# EAGLE design SBC-Accelerometer-v10 (EAGLE 6.3)
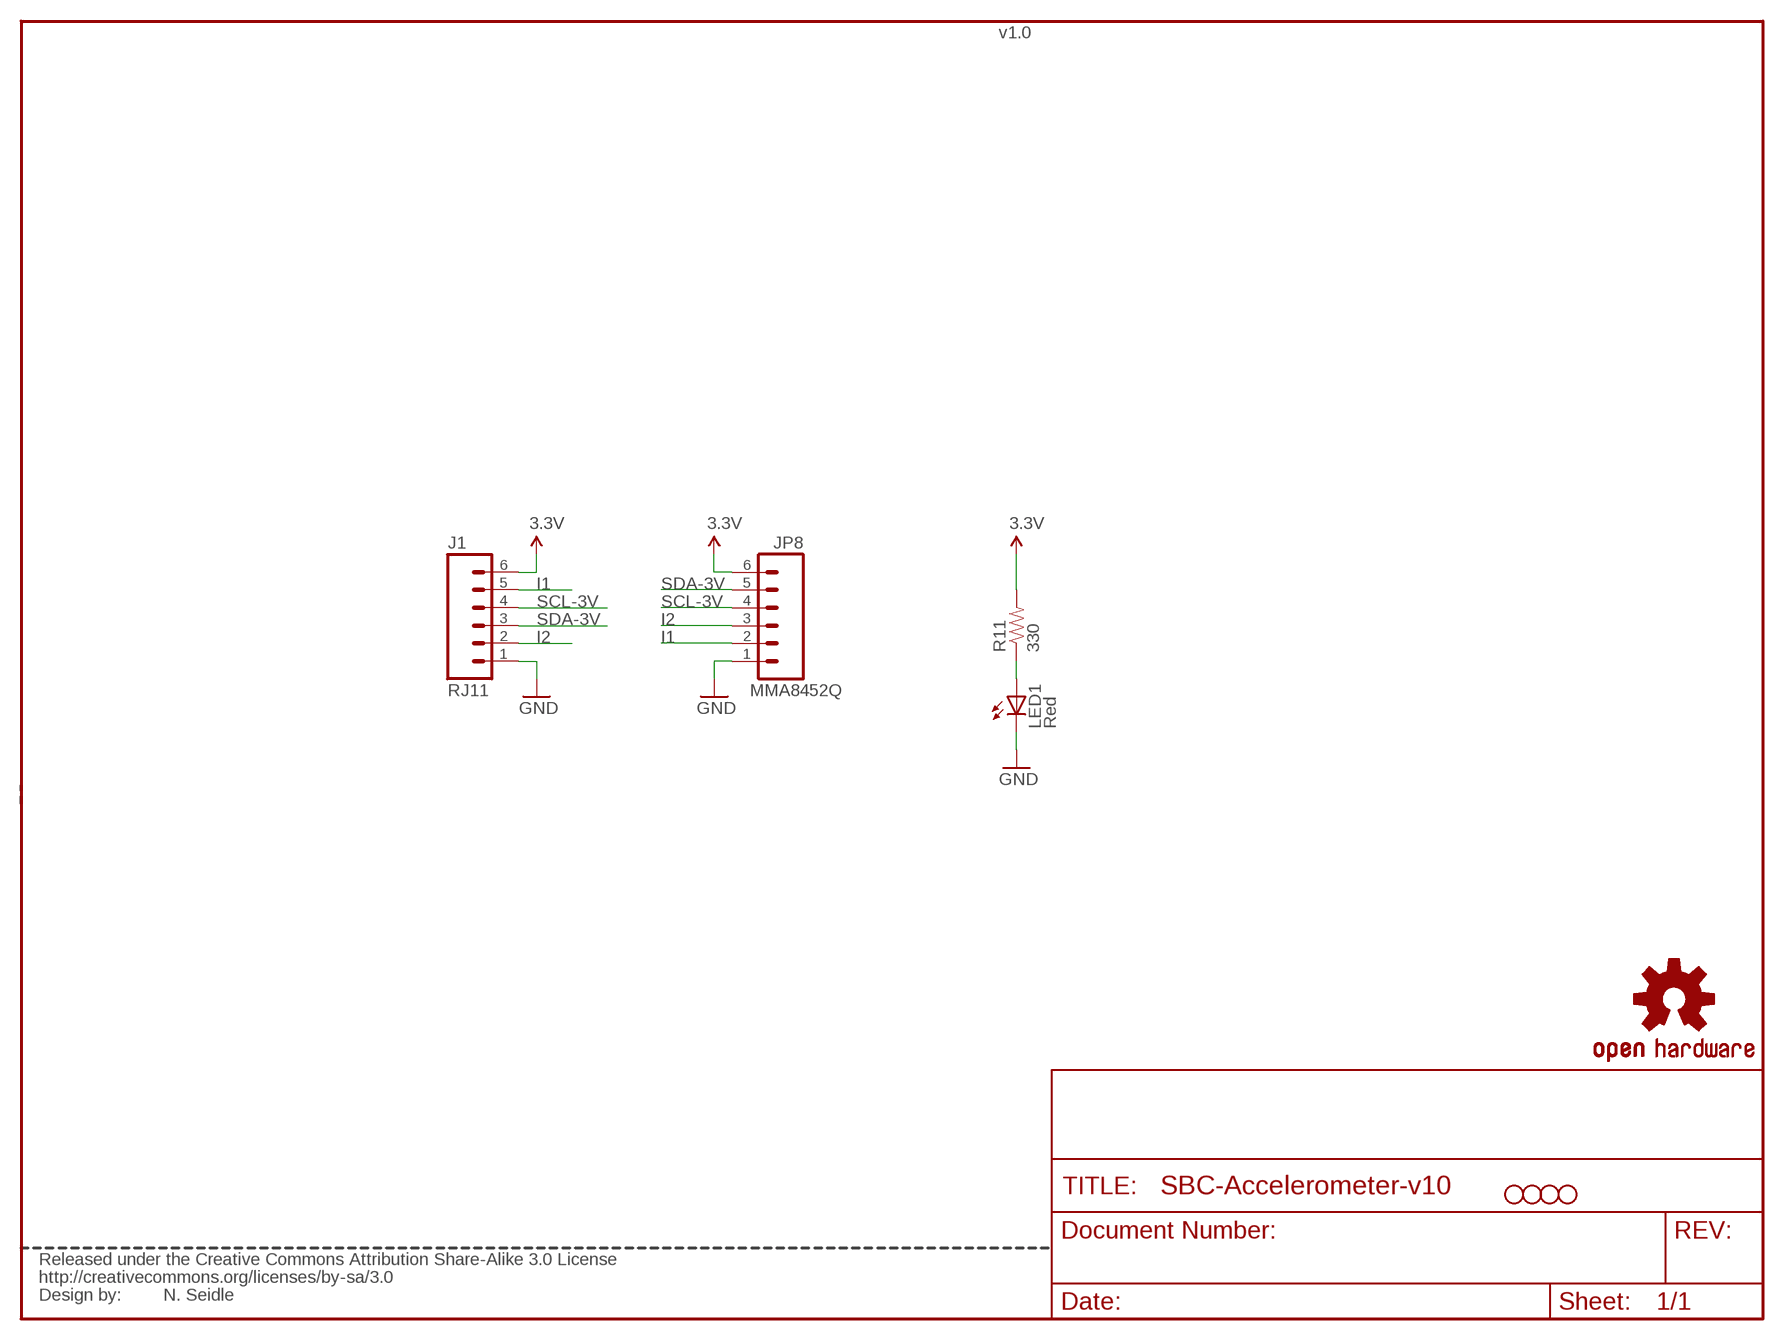
[diagram p0: schematic, sheet 1]

## Parts
J1  RJ11  RJ11-6PTH  [RJ11-6]
JP3  STAND-OFF  [STAND-OFF]
JP4  STAND-OFF  [STAND-OFF]
JP5  STAND-OFF  [STAND-OFF]
JP6  STAND-OFF  [STAND-OFF]
JP8  MMA8452Q  M06SIP  [1X06]
LED1  Red  LED3MM  [LED3MM]
R11  330  RESISTORAXIAL-0.3  [AXIAL-0.3]
U$3  CREATIVE_COMMONS  [CREATIVE_COMMONS]
U$4  OSHW-LOGOS  [OSHW-LOGO-S]

## Nets
3.3V: J1.6 JP8.6 R11.P$2
GND: J1.1 JP8.1 LED1.K(C)
I1: J1.5 JP8.2
I2: J1.2 JP8.3
N$38: LED1.A R11.P$1
SCL-3V: J1.4 JP8.4
SDA-3V: J1.3 JP8.5

## Notes on the sheet
- v1.0
- N. Seidle

## Library data of the parts
J1 = SparkFun-Connectors:RJ11-6: RJ11 Jack Simple 6 pin RJ11 jack. Commonly found on CAT3 devices and Microchip programmers. SKU: PRT-00132
JP3-JP6 = SparkFun-Electromechanical:STAND-OFF: #4 Stand Off This is the mechanical footprint for a #4 phillips button head screw. Use the keepout ring to avoid running the screw head into surrounding components. SKU : PRT-00447
JP8 = SparkFun-Connectors:M06: Header 6 Standard 6-pin 0.1" header. Use with straight break away headers (SKU : PRT-00116), right angle break away headers (PRT-00553), swiss pins (PRT-00743), machine pins (PRT-00117), and female headers (PRT-00115). Molex polarized connector foot print use with SKU : PRT-08094 with associated crimp pins and housings. NOTES ON THE VARIANTS LOCK and LOCK_LONGPADS... This footprint was designed to help hold the alignment of a through-hole component (i.e. 6-pin header) while soldering it into place. You may notice that each hole has been shifted either up or down by 0.005 of an inch from it's more standard position (which is a perfectly straight line). This slight alteration caused the pins (the squares in the middle) to touch the edges of the holes. Because they are alternating, it causes a "brace" to hold the component in place. 0.005 has proven to be the perfect amount of "off-center" position when using our standard breakaway headers. Although looks a little odd when you look at the bare footprint, once you have a header in there, the alteration is very hard to notice. Also, if you push a header all the way into place, it is covered up entirely on the bottom side. This idea of altering the position of holes to aid alignment will be further integrated into the Sparkfun Library for other footprints. It can help hold any component with 3 or more connection pins.
LED1 = SparkFun:LED: LEDs Standard schematic elements and footprints for 5mm, 3mm, 1206, and 0603 sized LEDs. 5mm - Spark Fun Electronics SKU : COM-00529 (and others)
R11 = SparkFun:RESISTOR: Resistor Basic schematic elements and footprints for 0603, 1206, and PTH resistors.
U$3 = SparkFun:CREATIVE_COMMONS
U$4 = SparkFun-Aesthetics:OSHW-LOGO: Open Source Hardware Logo This logo indicates the piece of hardware it is found on incorporates a OSHW license and/or adheres to the definition of open source hardware found here: http://freedomdefined.org/OSHW

## Board
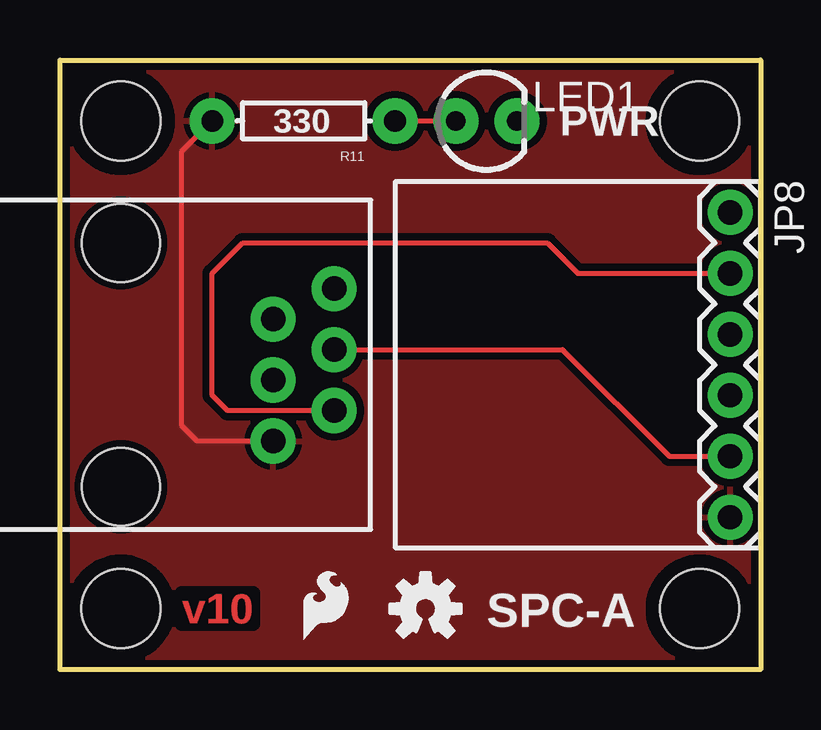
[diagram p1: board, top side]
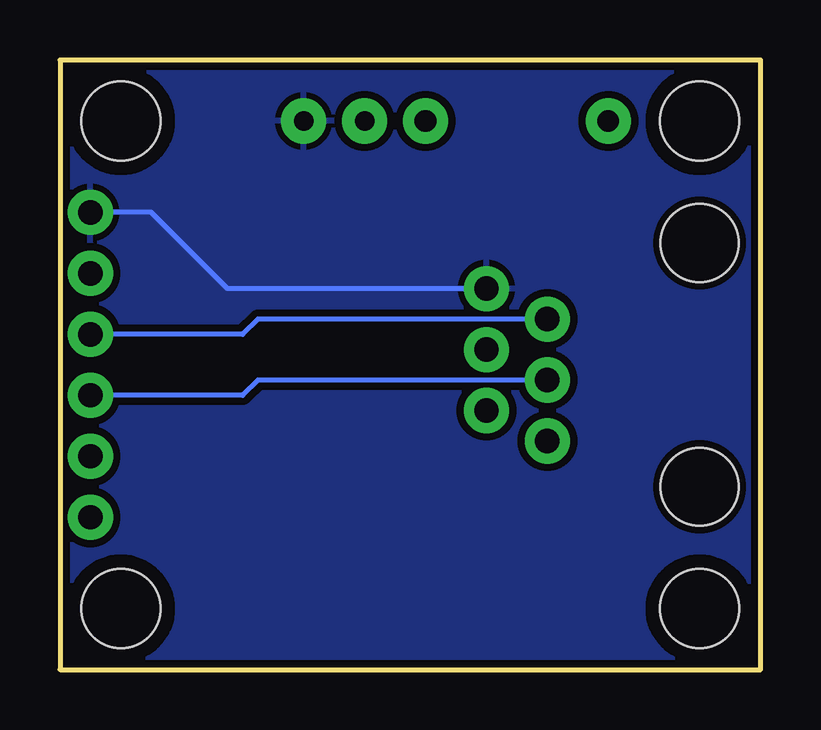
[diagram p2: board, bottom side, seen from below]

Size 29.21 x 25.4 mm. Coordinates in mm from the lower left corner, seen from the top.
Outline: 29.21,25.4 29.21,0 0,0 0,25.4 29.21,25.4
Copper layers (1*16): Top 0.035mm / dielectric 1.5mm / Bottom 0.035mm
Design rules "default": minimum track width 8mil, minimum drill 20mil, track to track 8mil, track to pad 8mil, pad to pad 8mil, via to via 8mil, smd to smd 8mil, copper to edge 10mil, drill to drill 8mil, minimum pad ring 12mil, minimum via ring 10mil, stop-mask expansion 4mil, vias tented up to drill 20mil, thermal gap 10mil

### Footprints (pad centres in the part's own frame; a part is rotated, then mirrored left to right if it is on the bottom)
RJ11-6 = drill 1.016 pad 1.88: 1 1.905,8.89; 2 3.175,6.35; 3 4.445,8.89; 4 5.715,6.35; 5 6.985,8.89; 6 8.255,6.35 | hole 3.251: 0,0; 10.16,0
STAND-OFF = hole 3.302: 0,0
1X06 = drill 1.016 pad 1.88: 1 0,0; 2 2.54,0; 3 5.08,0; 4 7.62,0; 5 10.16,0; 6 12.7,0
LED3MM = drill 0.813 pad 1.88: A -1.27,0; K 1.27,0
AXIAL-0.3 = drill 0.9 pad 1.88: P$1 -3.81,0; P$2 3.81,0

### Placement (x,y rotation side)
J1  2.54,17.78 270 top
JP3  26.67,22.86 0 top
JP4  2.54,22.86 0 top
JP5  26.67,2.54 0 top
JP6  2.54,2.54 0 top
JP8  27.94,19.05 270 top
LED1  17.78,22.86 0 top
R11  10.16,22.86 180 top
U$1  LOGO-SFESK  [SFE-LOGO-FLAME]  10.16,1.27 0 top
U$3  -8.89,-31.75 0 top  (outside the outline)
U$4  15.24,2.54 0 top

### Tracks (layer width: path | path; a pad name or v marks a point on that pad's centre or on a via)
3.3V
  Top 0.203: J1.6 5.72,9.52 5.08,10.16 5.08,21.59 R11.P$2
  pour Top (isolate 0.305): 0,0 0,25.4 29.21,25.4 29.21,0
GND
  Bottom 0.203: J1.1 22.23,15.88 25.4,19.05 JP8.1
  pour Bottom (isolate 0.305): 0,0 0,25.4 29.21,25.4 29.21,0
I1
  Top 0.203: J1.5 6.99,10.79 6.35,11.43 6.35,16.51 7.62,17.78 20.32,17.78 21.59,16.51 JP8.2
I2
  Bottom 0.203: J1.2 20.96,14.6 21.59,13.97 JP8.3
N$38
  Top 0.203: R11.P$1 LED1.A
SCL-3V
  Bottom 0.203: J1.4 20.96,12.06 21.59,11.43 JP8.4
SDA-3V
  Top 0.203: J1.3 20.96,13.33 25.4,8.89 JP8.5

### Text on the board
Top: v10
tPlace: PWR | SPC-A | N. Seidle
Measures: 1.20 | 0.15 | 1.30 | 1.50 | 1.0236 | 0.7173 | All dimensions are in inches. | 1.40